# Altium schematic sheet HPS_USB.SchDoc
size A4; Organization: ICNS, MARCS Institute; Address1: Werrington South Campus, Great Western Highway; Address2: Werrington, NSW, 2747; SheetNumber: 11; SheetTotal: 16
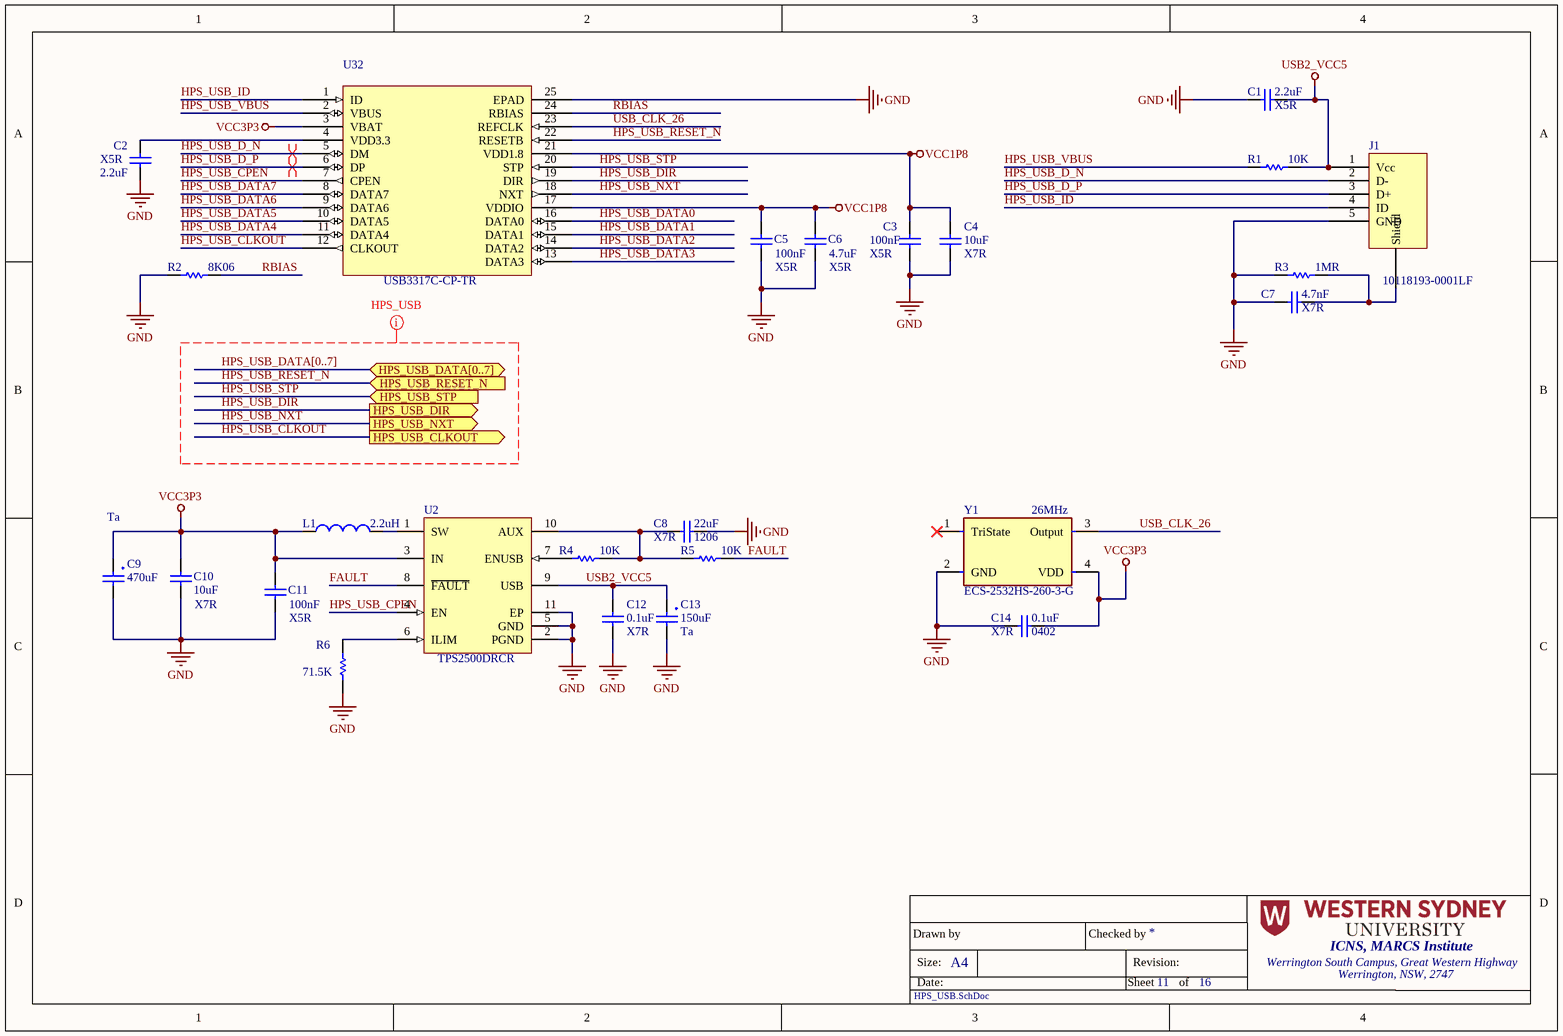
[diagram p0: HPS_USB.SchDoc]

## Parts
C1  Dielectric: X5R  Capacitance: 2.2uF  [CAP 0402 (1005)]  (hidden comment: CC0402KRX5R5BB225)
C2  Dielectric: X5R  Capacitance: 2.2uF  [CAP 0402 (1005)]  (hidden comment: CC0402KRX5R5BB225)
C3  Capacitance: 100nF  Dielectric: X5R  [CAP 0201 (0603)]  (hidden comment: CL03A104KP3NNNC)
C4  Dielectric: X7R  Capacitance: 10uF  [CAP 0805 (2012)]  (hidden comment: GCM21BR71A106KE22K)
C5  Capacitance: 100nF  Dielectric: X5R  [CAP 0201 (0603)]  (hidden comment: CL03A104KP3NNNC)
C6  Capacitance: 4.7uF  Dielectric: X5R  [CAP 0402 (1005)]  (hidden comment: C1005X5R1A475K050BC)
C7  value 4.7nF  Dielectric: X7R  [CAP 0201 (0603)]  (hidden comment: CC0201KRX7R5BB472)
C8  value 22uF  Dielectric: X7R  Case Code (Imperial): 1206  [CAPC3216X18N]  (hidden comment: CL31B226KPHNFNE)
C9  Capacitance: 470uF  Dielectric: Ta  [CAPCP3528X20M]  (hidden comment: F950J477MBAAQ2)
C10  value 10uF  Dielectric: X7R  [CAP 0805 (2012)]  (hidden comment: GCM21BR71A106KE22K)
C11  Capacitance: 100nF  Dielectric: X5R  [CAP 0201 (0603)]  (hidden comment: CL03A104KP3NNNC)
C12  value 0.1uF  Dielectric: X7R  [CAP 0402 (1005)]  (hidden comment: C0402C104M8RACTU)
C13  Capacitance: 150uF  Dielectric: Ta  [CAPMP7344X31N]  (hidden comment: TAJD157K010RNJ)
C14  value 0.1uF  Dielectric: X7R  Case/Package: 0402  [CAP 0402 (1005)]  (hidden comment: C0402C104M8RACTU)
J1  10118193-0001LF  [Micro USB]
L1  value 2.2uH  [FP-LQM18FN_00-IPC_A]  (hidden comment: LQM18FN2R2M00D)
R1  value 10K  [RES 0201 (0603)]  (hidden comment: AC0201FR-0710KL)
R2  value 8K06  [RES 0201 (0603)]  (hidden comment: RC0201FR-078K06L)
R3  value 1MR  [RES 0201 (0603)]  (hidden comment: ERJ-1GNF1004C)
R4  value 10K  [RES 0201 (0603)]  (hidden comment: AC0201FR-0710KL)
R5  value 10K  [RES 0201 (0603)]  (hidden comment: AC0201FR-0710KL)
R6  Resistance: 71.5K  [RES 0603 (1608)]  (hidden comment: RQ73C1J71K5BTD)
U2  TPS2500DRCR  [DRC0010J_V]
U32  CMP-008-000010-1  [QFN24_4X4MC_MCH]  (value not drawn)
Y1  ECS-2532HS-260-3-G  Frequency: 26MHz  [DFN210P320X110-4N]

## Ports
HPS_USB_CLKOUT (out), HPS_USB_DATA[0..7] (bidir), HPS_USB_DIR (out), HPS_USB_NXT (out), HPS_USB_RESET_N (in), HPS_USB_STP (in)

## Nets
GND: C1.2 C2.2 C3.2 C4.2 C5.2 C6.2 C7.1 C8.2 C9.2 C10.2 C11.1 C12.2 C13.2 C14.2 J1.5(GND) R2.1 R3.1 R6.2 U2.2(PGND) U2.5(GND) U2.11(EP) U32.25(EPAD) Y1.2(GND)
USB2_VCC5: C1.1 C12.1 C13.1 J1.1(Vcc) R1.2 U2.9(USB)
VCC1P8: C3.1 C4.1 C5.1 C6.1 U32.17(VDDIO) U32.21(VDD1.8)
VCC3P3: C9.1 C10.1 C11.2 C14.1 L1.1 U2.3(IN) U32.3(VBAT) Y1.4(VDD)
FAULT: R5.1 U2.8(~{FAULT})
HPS_USB_CLKOUT: U32.12(CLKOUT) ; port HPS_USB_CLKOUT
HPS_USB_CPEN: U2.4(EN) U32.7(CPEN)
HPS_USB_D_N: J1.2(D-) U32.5(DM)
HPS_USB_D_P: J1.3(D+) U32.6(DP)
HPS_USB_DATA0: U32.16(DATA0)
HPS_USB_DATA1: U32.15(DATA1)
HPS_USB_DATA2: U32.14(DATA2)
HPS_USB_DATA3: U32.13(DATA3)
HPS_USB_DATA4: U32.11(DATA4)
HPS_USB_DATA5: U32.10(DATA5)
HPS_USB_DATA6: U32.9(DATA6)
HPS_USB_DATA7: U32.8(DATA7)
HPS_USB_DIR: U32.19(DIR) ; port HPS_USB_DIR
HPS_USB_ID: J1.4(ID) U32.1(ID)
HPS_USB_NXT: U32.18(NXT) ; port HPS_USB_NXT
HPS_USB_RESET_N: U32.22(RESETB) ; port HPS_USB_RESET_N
HPS_USB_STP: U32.20(STP) ; port HPS_USB_STP
HPS_USB_VBUS: R1.1 U32.2(VBUS)
RBIAS: R2.2 U32.24(RBIAS)
USB_CLK_26: U32.23(REFCLK) Y1.3(Output)
NetC2_1: C2.1 U32.4(VDD3.3)
NetC7_2: C7.2 J1.0(Shield) R3.2
NetC8_1: C8.1 R4.1 R5.2 U2.10(AUX)
NetL1_2: L1.2 U2.1(SW)
NetR4_2: R4.2 U2.7(ENUSB)
NetR6_1: R6.1 U2.6(ILIM)

Not connected (* = marked no-connect by the designer): Y1 1(TriState)*

## Buses and harness runs
bus HPS_USB_DATA[0..7] = port HPS_USB_DATA[0..7]

## Layout directives
differential pair; differential pair class HPS_USB_D; net class DIGITAL: HPS_USB_D_N, HPS_USB_D_P
net class HPS_USB: HPS_USB_CLKOUT, HPS_USB_DATA[0..7], HPS_USB_DIR, HPS_USB_NXT, HPS_USB_RESET_N, HPS_USB_STP

## Notes on the sheet
- Drawn by
- Size:
- Date:
- A4
- Checked by
- Sheet
- Revision:
- of

## Library data of the parts
C1 C2 = CMP-003-000031-1: Cap Ceramic 2.2uF 6.3V X5R 10% SMD 0402 85C Paper T/R; Manufacturer: Yageo; Value: 2.2uF; Max Operating Temperature: 85°C; Case/Package: 0402; Min Operating Temperature: -55°C; Voltage Rating: 6.3V; RoHS Compliant: Yes; Tolerance: 10%; ComponentLink2URL: http://www.yageo.com/documents/recent/UPY-GPHC_X5R_4V-to-50V_25.pdf?src-supplier=Digi-Key; Voltage Rating (DC): 6.3V; ComponentLink3URL: http://www.yageo.com/exep/pages/download/literatures/ProductSelectionGuide%202014_Final_2.pdf?src-supplier=Digi-Key; Resistor Type: Ceramic; Packaging: Tape and Reel; Case Code (Metric): 1005; ComponentLink3Description: http://www.yageo.com/exep/pages/download/literatures/ProductSelectionGuide%202014_Final_2.pdf?src-supplier=Digi-Key; Lead Free: Lead Free; Design Item ID: CC0402KRX5R5BB225; Category: Ceramic Capacitors; Mount: Surface Mount; Halogen Free: Halogen Free; Manufacturer Part Number: CC0402KRX5R5BB225; ComponentLink2Description: http://www.yageo.com/documents/recent/UPY-GPHC_X5R_4V-to-50V_25.pdf?src-supplier=Digi-Key; Series: CC; Case Code (Imperial): 0402; Dissipation Factor: 10%; Height: 0.5mm; ComponentLink1Description: http://www.mouser.com/ds/2/447/UPY-GPHC_X5R_4V-to-50V_24-1109650.pdf?src-supplier=Mouser; RoHS: Yes; Stock 1: 10000; Radiation Hardening: No; Construction: Flat; Depth: 0.5mm; Termination: SMD/SMT; Width: 0.02inch; Pricing 1: 1=0.03110 (USD); Length: 1mm; ComponentLink1URL: http://www.mouser.com/ds/2/447/UPY-GPHC_X5R_4V-to-50V_24-1109650.pdf?src-supplier=Mouser; Source: ICNS_PropheseeLib.SchLib; Thickness: 0.022inch
C3 C5 C11 = CMP-003-000014-1: Cap Ceramic 0.1uF 10V X5R 10% Pad SMD 0201 85C T/R; Manufacturer: Samsung; Manufacturer Part Number: CL03A104KP3NNNC; Lead Free: Lead Free; RoHS: Yes; Voltage Rating: 10V; ComponentLink2URL: https://datasheet.ciiva.com/26838/getdatasheetpartid-357484-26838083.pdf?src-supplier=Verical; ComponentLink2Description: https://datasheet.ciiva.com/26838/getdatasheetpartid-357484-26838083.pdf?src-supplier=Verical; Tolerance: 10%; Height: 0.3mm; Category: Ceramic Capacitors; Case Code (Imperial): 0201; Source: ICNS_PropheseeLib.SchLib; Depth: 0.3mm; Mount: Surface Mount; Stock 1: 12175; Package Quantity: 1; Packaging: Tape and Reel; ComponentLink1Description: https://datasheet.ciiva.com/25803/cl03a104kp3nnnc-25803204.pdf?src-supplier=Digi-Key; Case Code (Metric): 0603; Width: 0.012inch; Length: 0.6mm; Radiation Hardening: No; Series: CL; Thickness: 0.013inch; Max Operating Temperature: 85°C; Design Item ID: CL03A104KP3NNNC; Voltage Rating (DC): 10V; Case/Package: 0201; Contact Plating: Tin; Min Operating Temperature: -55°C; Construction: Flat; Pricing 1: 1=0.10000, 10=0.02900, 50=0.01600, 100=0.01300, 500=0.00932, 1000=0.00732, 2500=0.00666, 5000=0.00612 (USD); ComponentLink1URL: https://datasheet.ciiva.com/25803/cl03a104kp3nnnc-25803204.pdf?src-supplier=Digi-Key
  C3 C5: Value: 0.1uF
C4 = CMP-003-000011-1: 0805 10 uF 10 V ±10 % Tolerance X7R Surface Mount Multilayer Ceramic Capacitor; Manufacturer: Murata; Value: 10uF; Tolerance: 10%; Voltage Rating: 10V; Case Code (Imperial): 0805; Category: Ceramic Capacitors; Height: 1.25mm; Mount: Surface Mount; Design Item ID: GCM21BR71A106KE22K; Voltage Rating (DC): 10V; Case Code (Metric): 2012; Ratings: AEC-Q200; RoHS: Yes; Case/Package: 0805; ComponentLink3URL: http://search.murata.co.jp/Ceramy/image/img/A01X/partnumbering_e_02.pdf?src-supplier=Digi-Key; Weight: 0.000335oz; Package Quantity: 10000; ComponentLink4Description: http://search.murata.co.jp/Ceramy/image/img/A01X/G101/ENG/GCM21BR71A106KE22-01.pdf?src-supplier=Digi-Key; Max Operating Temperature: 125°C; RoHS Compliant: Yes; Thickness: 0.055inch; Manufacturer Part Number: GCM21BR71A106KE22K; Packaging: Tape and Reel; Width: 1.25mm; ComponentLink1URL: http://www.mouser.com/ds/2/281/c03e-806517.pdf?src-supplier=Mouser; ComponentLink1Description: http://www.mouser.com/ds/2/281/c03e-806517.pdf?src-supplier=Mouser; ComponentLink2Description: https://search.murata.co.jp/Ceramy/image/img/A01X/G101/ENG/GCM21BR71A106KE22-01.pdf?src-supplier=Digi-Key; ComponentLink2URL: https://search.murata.co.jp/Ceramy/image/img/A01X/G101/ENG/GCM21BR71A106KE22-01.pdf?src-supplier=Digi-Key; Source: ICNS_PropheseeLib.SchLib; Pricing: 1=0.45000, 10=0.31600, 50=0.23880, 100=0.20790, 500=0.15400, 1000=0.13090, 2500=0.12320, 5000=0.11550 (USD); Length: 0.079inch; Stock: 4655; ComponentLink4URL: http://search.murata.co.jp/Ceramy/image/img/A01X/G101/ENG/GCM21BR71A106KE22-01.pdf?src-supplier=Digi-Key; Termination: SMD/SMT; ComponentLink3Description: http://search.murata.co.jp/Ceramy/image/img/A01X/partnumbering_e_02.pdf?src-supplier=Digi-Key; Min Operating Temperature: -55°C
C6 = CMP-003-000024-1: Cap Multilayer Ceramic 4.7uF 10 V X5R ±10 % SMT 0402  C Series; Manufacturer: TDK; Voltage Rating: 10V; Tolerance: 10%; Manufacturer Part Number: C1005X5R1A475K050BC; Lead Free: Lead Free; RoHS: Yes; ComponentLink2URL: https://datasheet.ciiva.com/14895/tdkmlcccaprange-14895671.pdf?src-supplier=Digi-Key; Value: 4.7uF; ComponentLink2Description: https://datasheet.ciiva.com/14895/tdkmlcccaprange-14895671.pdf?src-supplier=Digi-Key; Category: Ceramic Capacitors; Case Code (Imperial): 0402; Source: ICNS_PropheseeLib.SchLib; Mount: Surface Mount; Stock 1: 490145; Package Quantity: 10000; Packaging: Cut Tape; ComponentLink1Description: https://datasheet.ciiva.com/14895/tdkmlcccaprange-14895670.pdf?src-supplier=Digi-Key; Case Code (Metric): 1005; Width: 0.02inch; Length: 0.039inch; Series: C; Thickness: 0.022inch; Max Operating Temperature: 85°C; Design Item ID: C1005X5R1A475K050BC; Voltage Rating (DC): 10V; Case/Package: 0402; Min Operating Temperature: -55°C; Pricing 1: 1=0.48000, 10=0.33000, 50=0.23100, 100=0.19800, 500=0.14850, 1000=0.12540, 2500=0.11880, 5000=0.11220 (USD); ComponentLink1URL: https://datasheet.ciiva.com/14895/tdkmlcccaprange-14895670.pdf?src-supplier=Digi-Key; ComponentLink3Description: https://datasheet.ciiva.com/14895/tdkmlcccaprange-14895672.pdf?src-supplier=Digi-Key; REACH SVHC: No SVHC; ComponentLink3URL: https://datasheet.ciiva.com/14895/tdkmlcccaprange-14895672.pdf?src-supplier=Digi-Key; Dielectric Material: Ceramic
C7 = CMP-003-000018-1: Cap Ceramic 4.7nF 6.3V X7R 10% Pad SMD 0201 125C Automotive T/R; Manufacturer: Yageo; Voltage Rating: 6.3V; ComponentLink1Description: https://datasheet.ciiva.com/176/mlccorderingcode-176532.pdf?src-supplier=Digi-Key; Case Code (Metric): 0603; Width: 0.012inch; Thickness: 0.013inch; Category: Ceramic Capacitors; Pricing 1: 1=0.10000, 10=0.02400, 50=0.01320, 100=0.01080, 500=0.00770, 1000=0.00605, 2500=0.00550, 5000=0.00506 (USD); Source: ICNS_PropheseeLib.SchLib; Lead Free: Lead Free; Max Operating Temperature: 125°C; Termination: SMD/SMT; ComponentLink2Description: https://datasheet.ciiva.com/176/mlccorderingcode-176533.pdf?src-supplier=Digi-Key; ComponentLink3URL: https://datasheet.ciiva.com/176/mlccorderingcode-176531.pdf?src-supplier=Digi-Key; Case/Package: 0201; Voltage Rating (DC): 6.3V; RoHS: Yes; Series: CC; Tolerance: 10%; Resistor Type: Ceramic; Case Code (Imperial): 0201; Packaging: Tape and Reel; Capacitance: 4.7nF; Manufacturer Part Number: CC0201KRX7R5BB472; RoHS Compliant: Yes; Design Item ID: CC0201KRX7R5BB472; ComponentLink1URL: https://datasheet.ciiva.com/176/mlccorderingcode-176532.pdf?src-supplier=Digi-Key; Mount: Surface Mount; ComponentLink2URL: https://datasheet.ciiva.com/176/mlccorderingcode-176533.pdf?src-supplier=Digi-Key; Min Operating Temperature: -55°C; Stock 1: 3450; Length: 0.024inch; Halogen Free: Halogen Free; Weight: 6E-06oz; Package Quantity: 1; ComponentLink3Description: https://datasheet.ciiva.com/176/mlccorderingcode-176531.pdf?src-supplier=Digi-Key
C8 = CMP-003-000002-1: Cap Ceramic 22uF 10V X7R 10% SMD 1206 125°C Embossed Plastic T/R; Manufacturer: Samsung; Capacitance: 22uF; Voltage Rating: 10V; ComponentLink1URL: https://datasheet.ciiva.com/25724/cl31b226kphnfne-25724451.pdf?src-supplier=Digi-Key; Source: ICNS_PropheseeLib.SchLib; RoHS: Yes; Manufacturer Part Number: CL31B226KPHNFNE; Design Item ID: CL31B226KPHNFNE; Category: Ceramic Capacitors; ComponentLink1Description: https://datasheet.ciiva.com/25724/cl31b226kphnfne-25724451.pdf?src-supplier=Digi-Key; Stock: 17063; Mount: Surface Mount; Thickness: 0.071inch; Tolerance: 10%; Case/Package: 1206; Max Operating Temperature: 125°C; Min Operating Temperature: -55°C; Pricing: 1=0.49000, 10=0.34700, 50=0.26260, 100=0.22870, 500=0.16940, 1000=0.14399 (USD); Package Quantity: 1; Width: 0.063inch; Packaging: Tape and Reel; Case Code (Metric): 3216; Length: 0.126inch
C9 = CMP-003-000030-1: Cap Tant Solid 470uF 6.3V B CASE 20% 3528-20; Manufacturer: Kyocera AVX; Life (Hours): 2000Hour; ESR (Equivalent Series Resistance): 500mR; Mount: Surface Mount; Min Operating Temperature: -55°C; Max Operating Temperature: 125°C; ComponentLink1Description: http://datasheets.avx.com/F95.pdf?src-supplier=Digi-Key; Packaging: Tape and Reel; ComponentLink1URL: http://datasheets.avx.com/F95.pdf?src-supplier=Digi-Key; Case/Package: 1411; Case Code (Imperial): 1411; Voltage Rating: 6.3V; Value: 470uF; Category: Tantalum Capacitors; Features: General Purpose; Tolerance: 20%; RoHS: Yes; Case Code (Metric): 3528; Stock 1: 390; Pricing 1: 1=1.86390, 10=1.51770, 25=1.51030, 100=1.12080, 250=1.11860 (USD); Design Item ID: F950J477MBAAQ2; Source: ICNS_PropheseeLib.SchLib; RoHS Compliant: Yes; Manufacturer Part Number: F950J477MBAAQ2
C10 = CMP-003-000011-1: 0805 10 uF 10 V ±10 % Tolerance X7R Surface Mount Multilayer Ceramic Capacitor; Manufacturer: Murata; Voltage Rating (DC): 10V; Tolerance: 10%; Packaging: Tape and Reel; Width: 1.25mm; Termination: SMD/SMT; Package Quantity: 10000; Voltage Rating: 10V; Capacitance: 10uF; Case/Package: 0805; Min Operating Temperature: -55°C; Length: 0.079inch; Thickness: 0.055inch; Case Code (Imperial): 0805; Max Operating Temperature: 125°C; Height: 1.25mm; Mount: Surface Mount; Case Code (Metric): 2012; Category: Ceramic Capacitors; Design Item ID: GCM21BR71A106KE22K; Ratings: AEC-Q200; RoHS: Yes; ComponentLink3URL: http://search.murata.co.jp/Ceramy/image/img/A01X/partnumbering_e_02.pdf?src-supplier=Digi-Key; Weight: 0.000335oz; ComponentLink4Description: http://search.murata.co.jp/Ceramy/image/img/A01X/G101/ENG/GCM21BR71A106KE22-01.pdf?src-supplier=Digi-Key; RoHS Compliant: Yes; Manufacturer Part Number: GCM21BR71A106KE22K; ComponentLink1URL: http://www.mouser.com/ds/2/281/c03e-806517.pdf?src-supplier=Mouser; ComponentLink1Description: http://www.mouser.com/ds/2/281/c03e-806517.pdf?src-supplier=Mouser; ComponentLink2Description: https://search.murata.co.jp/Ceramy/image/img/A01X/G101/ENG/GCM21BR71A106KE22-01.pdf?src-supplier=Digi-Key; ComponentLink2URL: https://search.murata.co.jp/Ceramy/image/img/A01X/G101/ENG/GCM21BR71A106KE22-01.pdf?src-supplier=Digi-Key; Source: ICNS_PropheseeLib.SchLib; Pricing: 1=0.45000, 10=0.31600, 50=0.23880, 100=0.20790, 500=0.15400, 1000=0.13090, 2500=0.12320, 5000=0.11550 (USD); Stock: 4655; ComponentLink4URL: http://search.murata.co.jp/Ceramy/image/img/A01X/G101/ENG/GCM21BR71A106KE22-01.pdf?src-supplier=Digi-Key; ComponentLink3Description: http://search.murata.co.jp/Ceramy/image/img/A01X/partnumbering_e_02.pdf?src-supplier=Digi-Key
C12 C14 = CMP-003-000005-1: Cap Ceramic 0.1uF 10V X7R 20% SMD 0402 125°C Paper T/R; Manufacturer 1: KEMET; Capacitance: 100nF; Dissipation Factor: 5%; Voltage Rating: 10V; Tolerance: 20%; Max Operating Temperature: 125°C; Min Operating Temperature: -55°C; RoHS Compliant: Yes; Source: ICNS_PropheseeLib.SchLib; ComponentLink1Description: https://datasheet.ciiva.com/26948/getdatasheetpartid-791262-26948427.pdf?src-supplier=Verical; Description 1: Cap Ceramic 0.1uF 10V X7R 20% SMD 0402 125°C Paper T/R; RoHS: Yes; Package Quantity: 10000; Category: Ceramic Capacitors; Packaging: Tape and Reel; Length: 1mm; ComponentLink1URL: https://datasheet.ciiva.com/26948/getdatasheetpartid-791262-26948427.pdf?src-supplier=Verical; Lead Pitch: 0.3mm; Case Code (Imperial): 0402; Pricing 1: 1=0.00400, 25=0.00400, 100=0.00400, 250=0.00400, 500=0.00400, 1000=0.00400 (USD); Design Item ID: C0402C104M8RACTU; Radiation Hardening: No; Termination: SMD/SMT; Case Code (Metric): 1005; Stock 1: 32450; Manufacturer Part Number 1: C0402C104M8RACTU; Mount: Surface Mount; Dielectric Material: Ceramic; Depth: 0.5mm; Height: 0.5mm; Voltage Rating (DC): 10V; Thickness: 0.022inch; Series: C; Width: 0.02inch
  C12: Case/Package: 0402
C13 = CMP-003-000028-1: Cap Tant Solid 150uF 10V 2917 10%; Manufacturer: Kyocera AVX; Leakage Current: 15uA; Polarity: Polar; Dissipation Factor: 8%; ESR (Equivalent Series Resistance): 900mR; Manufacturer Part Number: TAJD157K010RNJ; Lead Free: Lead Free; RoHS: Yes; Voltage Rating: 10V; ComponentLink2URL: https://datasheet.ciiva.com/7773/1680476-7773718.pdf?src-supplier=Element14; Value: 150uF; ComponentLink2Description: https://datasheet.ciiva.com/7773/1680476-7773718.pdf?src-supplier=Element14; Tolerance: 10%; Height: 2.9mm; Category: Tantalum Capacitors; Case Code (Imperial): 2917; Source: ICNS_PropheseeLib.SchLib; Depth: 4.3mm; Mount: Surface Mount; Stock 1: 1000; Package Quantity: 1; Packaging: Tape and Reel; ComponentLink1Description: https://datasheet.ciiva.com/26341/559466-da-01-en-tacc-d-7-3-mm-x-4-3-mm-x-2-9-mm-150-uf-26341801.pdf?src-supplier=Conrad; Case Code (Metric): 7343; Width: 4.3mm; Length: 7.3mm; Radiation Hardening: No; Series: TAJ; Max Operating Temperature: 125°C; Design Item ID: TAJD157K010RNJ; Voltage Rating (DC): 10V; Case/Package: 2917; Min Operating Temperature: -55°C; Construction: Flat; Pricing 1: 1=0.91240, 10=0.70050, 25=0.69350, 100=0.50540, 250=0.50040, 500=0.48150, 1000=0.33940 (USD); ComponentLink1URL: https://datasheet.ciiva.com/26341/559466-da-01-en-tacc-d-7-3-mm-x-4-3-mm-x-2-9-mm-150-uf-26341801.pdf?src-supplier=Conrad; ComponentLink4Description: https://datasheet.ciiva.com/28515/taj-28515486.pdf?src-supplier=Element14; ComponentLink3Description: https://datasheet.ciiva.com/8080/1719052-8080375.pdf?src-supplier=Element14; ComponentLink7URL: https://datasheet.ciiva.com/264/taj-264812.pdf?src-supplier=Digi-Key; ComponentLink5Description: https://datasheet.ciiva.com/264/taj-264811.pdf?src-supplier=Digi-Key; ComponentLink6URL: https://datasheet.ciiva.com/264/taj-264810.pdf?src-supplier=Digi-Key; ComponentLink8Description: https://datasheet.ciiva.com/11228/taj-11228542.pdf?src-supplier=Avnet; ComponentLink4URL: https://datasheet.ciiva.com/28515/taj-28515486.pdf?src-supplier=Element14; ComponentLink8URL: https://datasheet.ciiva.com/11228/taj-11228542.pdf?src-supplier=Avnet; ComponentLink3URL: https://datasheet.ciiva.com/8080/1719052-8080375.pdf?src-supplier=Element14; Number of Pins: 2; Features: General Purpose; REACH SVHC: No SVHC; ComponentLink6Description: https://datasheet.ciiva.com/264/taj-264810.pdf?src-supplier=Digi-Key; ComponentLink9URL: https://datasheet.ciiva.com/16349/taj-16349831.pdf?src-supplier=Future+Electronics; ComponentLink9Description: https://datasheet.ciiva.com/16349/taj-16349831.pdf?src-supplier=Future+Electronics; Termination: SMD/SMT; ComponentLink7Description: https://datasheet.ciiva.com/264/taj-264812.pdf?src-supplier=Digi-Key; RoHS Compliant: Yes; Height - Seated (Max): 0.122inch; ComponentLink10URL: https://datasheet.ciiva.com/15163/getdatasheetpartid-111102-15163371.pdf?src-supplier=Verical; ComponentLink5URL: https://datasheet.ciiva.com/264/taj-264811.pdf?src-supplier=Digi-Key; ComponentLink10Description: https://datasheet.ciiva.com/15163/getdatasheetpartid-111102-15163371.pdf?src-supplier=Verical
J1 = CMP-010-000009-1: FCI Right Angle Surface Mount Mount Female USB Connector; 100 V ac; 1.8A; Manufacturer: Amphenol ICC / FCI; ComponentLink1URL: http://components.arrow.com/part/dataview/0323_04107372?src-supplier=Arrow+Europe; ComponentLink2URL: http://uk.rs-online.com/webdocs/1450/0900766b814507f1.pdf?src-supplier=RSComponents; ComponentLink1Description: http://components.arrow.com/part/dataview/0323_04107372?src-supplier=Arrow+Europe; ComponentLink3Description: https://cdn.amphenol-icc.com/media/wysiwyg/files/documentation/datasheet/inputoutput/io_usb_micro.pdf?src-supplier=Avnet; RoHS: No; ComponentLink3URL: https://cdn.amphenol-icc.com/media/wysiwyg/files/documentation/datasheet/inputoutput/io_usb_micro.pdf?src-supplier=Avnet; ComponentLink2Description: http://uk.rs-online.com/webdocs/1450/0900766b814507f1.pdf?src-supplier=RSComponents; ComponentLink13URL: https://cdn.amphenol-icc.com/media/wysiwyg/files/documentation/datasheet/inputoutput/io_usb_micro.pdf?src-supplier=TME; Source: ICNS_PropheseeLib.SchLib; ComponentLink9URL: https://cdn.amphenol-icc.com/media/wysiwyg/files/documentation/datasheet/inputoutput/io_usb_micro.pdf?src-supplier=Mouser; Stock 1: 3200; ComponentLink13Description: https://cdn.amphenol-icc.com/media/wysiwyg/files/documentation/datasheet/inputoutput/io_usb_micro.pdf?src-supplier=TME; Design Item ID: 10118193-0001LF; ComponentLink5Description: https://cdn.amphenol-icc.com/media/wysiwyg/files/documentation/datasheet/inputoutput/io_usb_micro.pdf?src-supplier=Onlinecomponents.com; Manufacturer Part Number: 10118193-0001LF; ComponentLink14Description: https://cdn.amphenol-icc.com/media/wysiwyg/files/documentation/datasheet/inputoutput/io_usb_micro.pdf?src-supplier=Heilind+Electronics; ComponentLink6Description: https://cdn.amphenol-icc.com/media/wysiwyg/files/documentation/datasheet/inputoutput/io_usb_micro.pdf?src-supplier=Verical; Category: USB Connectors; ComponentLink6URL: https://cdn.amphenol-icc.com/media/wysiwyg/files/documentation/datasheet/inputoutput/io_usb_micro.pdf?src-supplier=Verical; Pricing 1: 100=0.34000, 500=0.29900, 1000=0.25600, 2500=0.23900, 5000=0.22100 (USD); ComponentLink10Description: https://cdn.amphenol-icc.com/media/wysiwyg/files/documentation/datasheet/inputoutput/io_usb_micro.pdf?src-supplier=Allied+Electronics; ComponentLink11Description: https://cdn.amphenol-icc.com/media/wysiwyg/files/documentation/datasheet/inputoutput/io_usb_micro.pdf?src-supplier=RSComponents; ComponentLink9Description: https://cdn.amphenol-icc.com/media/wysiwyg/files/documentation/datasheet/inputoutput/io_usb_micro.pdf?src-supplier=Mouser; ComponentLink7URL: http://www.amphenol-icc.com/media/wysiwyg/files/drawing/10118193.pdf?src-supplier=Digi-Key; ComponentLink8Description: https://cdn.amphenol-icc.com/media/wysiwyg/files/documentation/datasheet/inputoutput/io_usb_micro.pdf?src-supplier=Digi-Key; ComponentLink5URL: https://cdn.amphenol-icc.com/media/wysiwyg/files/documentation/datasheet/inputoutput/io_usb_micro.pdf?src-supplier=Onlinecomponents.com; ComponentLink10URL: https://cdn.amphenol-icc.com/media/wysiwyg/files/documentation/datasheet/inputoutput/io_usb_micro.pdf?src-supplier=Allied+Electronics; ComponentLink12Description: https://cdn.amphenol-icc.com/media/wysiwyg/files/documentation/datasheet/inputoutput/io_usb_micro.pdf?src-supplier=TTI; ComponentLink8URL: https://cdn.amphenol-icc.com/media/wysiwyg/files/documentation/datasheet/inputoutput/io_usb_micro.pdf?src-supplier=Digi-Key; ComponentLink4Description: https://cdn.amphenol-icc.com/media/wysiwyg/files/documentation/datasheet/inputoutput/io_usb_micro.pdf?src-supplier=Arrow+Electronics; ComponentLink7Description: http://www.amphenol-icc.com/media/wysiwyg/files/drawing/10118193.pdf?src-supplier=Digi-Key; ComponentLink14URL: https://cdn.amphenol-icc.com/media/wysiwyg/files/documentation/datasheet/inputoutput/io_usb_micro.pdf?src-supplier=Heilind+Electronics; ComponentLink11URL: https://cdn.amphenol-icc.com/media/wysiwyg/files/documentation/datasheet/inputoutput/io_usb_micro.pdf?src-supplier=RSComponents; ComponentLink4URL: https://cdn.amphenol-icc.com/media/wysiwyg/files/documentation/datasheet/inputoutput/io_usb_micro.pdf?src-supplier=Arrow+Electronics; ComponentLink12URL: https://cdn.amphenol-icc.com/media/wysiwyg/files/documentation/datasheet/inputoutput/io_usb_micro.pdf?src-supplier=TTI
L1 = CMP-005-000006-1: Inductor Power Chip Shielded Multi-Layer 2.2uH 20% 1MHz Ferrite 0.12A 0.52Ohm DCR 0603 T/R; Manufacturer: Murata; DC Resistance (DCR): 520mR; DC Current: 120mA; Self Resonant Frequency: 80MHz; Military Standard: Not; ComponentLink4Description: https://datasheet.ciiva.com/1039/l0075s0097lqm18f-1039457.pdf?src-supplier=Digi-Key; ComponentLink4URL: https://datasheet.ciiva.com/1039/l0075s0097lqm18f-1039457.pdf?src-supplier=Digi-Key; Case/Package: 0603; ComponentLink2Description: https://datasheet.ciiva.com/3866/288lqm18fn2r2m0023-3866055.pdf?src-supplier=Arrow+Electronics; Tolerance: 20%; Mount: Surface Mount; ComponentLink1Description: https://datasheet.ciiva.com/1039/l0075s0097lqm18f-1039456.pdf?src-supplier=Digi-Key; Height - Seated (Max): 0.035inch; Shielding: Shielded; ComponentLink5URL: https://datasheet.ciiva.com/1039/l0075s0097lqm18f-1039458.pdf?src-supplier=Digi-Key; Lead Free: Lead Free; Min Operating Temperature: -55°C; Saturation Current: 120mA; Category: Fixed Inductors; Source: ICNS_PropheseeLib.SchLib; ComponentLink3URL: https://datasheet.ciiva.com/11802/0900766b80f15512-11802633.pdf?src-supplier=RSComponents; ComponentLink1URL: https://datasheet.ciiva.com/1039/l0075s0097lqm18f-1039456.pdf?src-supplier=Digi-Key; ComponentLink6Description: https://datasheet.ciiva.com/17277/l0075s0097lqm18f-17277643.pdf?src-supplier=Avnet+Europe; Max DC Current: 120mA; Length: 0.063inch; ComponentLink6URL: https://datasheet.ciiva.com/17277/l0075s0097lqm18f-17277643.pdf?src-supplier=Avnet+Europe; Manufacturer Part Number: LQM18FN2R2M00D; Pricing 1: 25=0.13900, 50=0.11800, 500=0.10500, 1000=0.09000, 2500=0.08300 (USD); Depth: 0.9mm; Weight: 7.1E-05oz; Test Frequency: 1MHz; Height: 0.9mm; Case Code (Imperial): 0603; ComponentLink5Description: https://datasheet.ciiva.com/1039/l0075s0097lqm18f-1039458.pdf?src-supplier=Digi-Key; ComponentLink3Description: https://datasheet.ciiva.com/11802/0900766b80f15512-11802633.pdf?src-supplier=RSComponents; Design Item ID: LQM18FN2R2M00D; ComponentLink2URL: https://datasheet.ciiva.com/3866/288lqm18fn2r2m0023-3866055.pdf?src-supplier=Arrow+Electronics; Series: LQM18F; Radiation Hardening: No; Inductance: 2.2uH; Width: 0.031inch; Packaging: Tape and Reel; Package Quantity: 4000; Termination: SMD/SMT; Case Code (Metric): 1608; Current Rating: 120mA; RoHS: Yes; Stock 1: 1; Core Material: Ferrite; Max Operating Temperature: 125°C
R1 R4 R5 = CMP-006-000021-1: Res Thick Film 0201 10K Ohm 1% 0.05W(1/20W) ±200ppm/C Pad SMD Automotive T/R; Manufacturer: Yageo; Max Power Dissipation: 50mW; Resistance: 10kR; Temperature Coefficient: 200ppm/°C; Length: 0.024inch; Packaging: Tape and Reel; ComponentLink1URL: http://www.yageo.com/NewPortal/yageodocoutput?fileName=/pdf/R-Chip/PYu-AC_51_RoHS_L_6.pdf&src-supplier=Digi-Key; Number of Terminations: 2; Case/Package: 0201; Source: ICNS_PropheseeLib.SchLib; Case Code (Metric): 0603; Manufacturer Part Number: AC0201FR-0710KL; ComponentLink1Description: http://www.yageo.com/NewPortal/yageodocoutput?fileName=/pdf/R-Chip/PYu-AC_51_RoHS_L_6.pdf&src-supplier=Digi-Key; Min Operating Temperature: -55°C; Category: Chip SMD Resistors; Width: 0.012inch; RoHS: Yes; Max Operating Temperature: 155°C; Features: Moisture Resistant,Automotive AEC-Q200; Pricing 1: 1=0.10000, 10=0.06600, 100=0.02670, 1000=0.01201, 2500=0.01042, 5000=0.00861 (USD); Case Code (Imperial): 0201; Resistor Type: Thick Film; Stock 1: 698280; Design Item ID: AC0201FR-0710KL; Height: 0.01inch; Tolerance: 1%
R2 = CMP-006-000054-1: Res Thick Film 0201 8.06K Ohm 1% 1/20W ±200ppm/°C Molded SMD Paper T/R; Manufacturer: Yageo; Resistance: 8.06kR; Max Power Dissipation: 50mW; Height: 0.01inch; Packaging: Tape and Reel; Length: 0.024inch; Case Code (Metric): 0603; Min Operating Temperature: -55°C; Case Code (Imperial): 0201; Tolerance: 1%; ComponentLink1URL: http://components.arrow.com/part/dataview/0323_03291877?src-supplier=Arrow+Europe; ComponentLink2URL: http://www.yageo.com.tw/exep/pages/download/literatures/PYu-R_INT-thick_7.pdf?src-supplier=Digi-Key; ComponentLink2Description: http://www.yageo.com.tw/exep/pages/download/literatures/PYu-R_INT-thick_7.pdf?src-supplier=Digi-Key; Max Operating Temperature: 125°C; ComponentLink1Description: http://components.arrow.com/part/dataview/0323_03291877?src-supplier=Arrow+Europe; Width: 0.012inch; Depth: 0.3mm; ComponentLink3Description: http://www.yageo.com/documents/recent/PYu-RC_Group_51_RoHS_L_9.pdf?src-supplier=Digi-Key; Number of Terminations: 2; ComponentLink3URL: http://www.yageo.com/documents/recent/PYu-RC_Group_51_RoHS_L_9.pdf?src-supplier=Digi-Key; Design Item ID: RC0201FR-078K06L; Case/Package: 0201; Resistor Type: Thick Film; RoHS Compliant: Yes; RoHS: Yes; Stock 1: 38520; Category: Chip SMD Resistors; Military Standard: Not; Manufacturer Part Number: RC0201FR-078K06L; Source: ICNS_PropheseeLib.SchLib; Features: Moisture Resistant; Pricing 1: 1=0.03600, 10=0.01500, 25=0.01200, 50=0.01000, 100=0.00700 (USD); Temperature Coefficient: 200ppm/°C
R3 = CMP-006-000042-1: Res Thick Film 0201 1M Ohm 1% 0.05W(1/20W) ±200ppm/C Pad SMD Automotive T/R; Manufacturer: Panasonic; Working Voltage: 25V; Max Power Dissipation: 50mW; Temperature Coefficient: 200ppm/°C; Technology: THICK FILM; Case Code (Metric): 0603; ComponentLink5URL: https://datasheet.ciiva.com/16201/aoa0000ce2-16201493.pdf?src-supplier=Future+Electronics; ComponentLink5Description: https://datasheet.ciiva.com/16201/aoa0000ce2-16201493.pdf?src-supplier=Future+Electronics; Resistor Type: Thick Film; ComponentLink4URL: https://datasheet.ciiva.com/22742/1678782-22742861.pdf?src-supplier=Element14; Length: 0.6mm; Max Operating Temperature: 125°C; Resistance Tolerance: 1%; ComponentLink2URL: https://datasheet.ciiva.com/46375/1678782-46375423.pdf?src-supplier=Element14; Min Operating Temperature: -55°C; Manufacturer Part Number: ERJ-1GNF1004C; Voltage Rating: 25V; Category: Chip SMD Resistors; Case/Package: 0201; ComponentLink3Description: https://datasheet.ciiva.com/22742/1678782-22742862.pdf?src-supplier=Element14; Package Quantity: 15000; RoHS: Yes; Radiation Hardening: No; Number of Terminations: 2; Voltage Rating (DC): 25V; Case Code (Imperial): 0201; Power Rating: 50mW; ComponentLink2Description: https://datasheet.ciiva.com/46375/1678782-46375423.pdf?src-supplier=Element14; ComponentLink3URL: https://datasheet.ciiva.com/22742/1678782-22742862.pdf?src-supplier=Element14; Tolerance: 1%; Design Item ID: ERJ-1GNF1004C; Mount: Surface Mount; Pricing 1: 1=0.10000, 10=0.06500, 100=0.02660, 1000=0.01192, 2500=0.01035, 5000=0.00855 (USD); Width: 0.3mm; Stock 1: 1665; REACH SVHC: No SVHC; Lead Free: Lead Free; Number of Pins: 2; Contact Plating: Tin,Matte; Source: ICNS_PropheseeLib.SchLib; Series: ERJ; Packaging: Tape and Reel; Resistance: 1MR; ComponentLink1URL: https://datasheet.ciiva.com/43467/1678782-43467126.pdf?src-supplier=Farnell; ComponentLink1Description: https://datasheet.ciiva.com/43467/1678782-43467126.pdf?src-supplier=Farnell; ComponentLink4Description: https://datasheet.ciiva.com/22742/1678782-22742861.pdf?src-supplier=Element14; Height: 0.01inch
R6 = CMP-006-000056-1: Res Thin Film 0603  71.5kOhm 0.1% 150mW 10ppm/°C 2-Pin SMD T/R; Manufacturer: TE Connectivity; Value: 71K5; Tolerance: 1%; RoHS: Yes; Manufacturer Part Number: RQ73C1J71K5BTD; Temperature Coefficient: 10ppm/°C; Category: Chip SMD Resistors; ComponentLink1Description: https://media.digikey.com/pdf/Data%20Sheets/Tyco%20Electronics%20P%20B%20PDFs/RQ73-0618%20v2.pdf?src-supplier=Digi-Key; Stock 1: 9106; Pricing 1: 1=0.83000, 10=0.68800, 100=0.46180, 1000=0.27018, 2500=0.26134 (USD); Max Power Dissipation: 150mW; Case/Package: 0603; Design Item ID: RQ73C1J71K5BTD; Source: ICNS_PropheseeLib.SchLib; Case Code (Metric): 1608; ComponentLink1URL: https://media.digikey.com/pdf/Data%20Sheets/Tyco%20Electronics%20P%20B%20PDFs/RQ73-0618%20v2.pdf?src-supplier=Digi-Key
U2 = CMP-012-000001-1: Power Switch/Driver 1:2 N/P-Channel 1.4A 10-VSON (3x3); Manufacturer: Texas Instruments; Number of Switches: 1; Max Supply Voltage: 5.25V; Min Input Voltage: 1.8V; Bandwidth: 1MHz; Number of Outputs: 2; ComponentLink1URL: https://datasheet.ciiva.com/3235/tps2501-3235090.pdf?src-supplier=Avnet; ComponentLink1Description: https://datasheet.ciiva.com/3235/tps2501-3235090.pdf?src-supplier=Avnet; Max Operating Temperature: 85°C; Design Item ID: TPS2500DRCR; Series: -; Manufacturer Part Number: TPS2500DRCR; Stock 1: 160; Lead Free: Lead Free; ComponentLink7URL: https://datasheet.ciiva.com/16467/tps2501-16467210.pdf?src-supplier=Avnet+Asia; Min Supply Voltage: 1.8V; ComponentLink6URL: https://datasheet.ciiva.com/1963/tps2500-1963868.pdf?src-supplier=Digi-Key; ComponentLink2Description: https://datasheet.ciiva.com/15108/getdatasheetpartid-534311-15108632.pdf?src-supplier=Verical; Case/Package: VSON; Min Operating Temperature: -40°C; ComponentLink7Description: https://datasheet.ciiva.com/16467/tps2501-16467210.pdf?src-supplier=Avnet+Asia; Number of Pins: 10; Package Quantity: 3000; Pricing 1: 1=2.10000, 10=1.89000, 25=1.78360, 100=1.51950, 250=1.42676, 500=1.24842, 1000=1.17775 (USD); Radiation Hardening: No; ComponentLink4URL: https://datasheet.ciiva.com/1963/tps2500-1963866.pdf?src-supplier=Digi-Key; ComponentLink5URL: https://datasheet.ciiva.com/1963/tps2500-1963867.pdf?src-supplier=Digi-Key; RoHS: Yes; RoHS Compliant: Yes; ComponentLink5Description: https://datasheet.ciiva.com/1963/tps2500-1963867.pdf?src-supplier=Digi-Key; ComponentLink3Description: https://datasheet.ciiva.com/26882/tps2500drcr-26882145.pdf?src-supplier=IIIC; Category: Hot Swap Controllers; Max Input Voltage: 5.25V; ComponentLink2URL: https://datasheet.ciiva.com/15108/getdatasheetpartid-534311-15108632.pdf?src-supplier=Verical; Packaging: Tape and Reel; ComponentLink6Description: https://datasheet.ciiva.com/1963/tps2500-1963868.pdf?src-supplier=Digi-Key; ComponentLink3URL: https://datasheet.ciiva.com/26882/tps2500drcr-26882145.pdf?src-supplier=IIIC; Source: ICNS_PropheseeLib.SchLib; ComponentLink4Description: https://datasheet.ciiva.com/1963/tps2500-1963866.pdf?src-supplier=Digi-Key
U32 = CMP-008-000010-1: Hi-Speed USB Transceiver with 1.8V-3.3V ULPI Interface - 26MHz Reference Clock; Manufacturer: Microchip; Data Rate: 480Mbps; Number of Transceivers: 1; Max Dual Supply Voltage: 5.5V; Operating Supply Voltage: 3.3V; ESD Protection: Yes; Width: 4.15mm; Mount: Surface Mount; Manufacturer Part Number: USB3317C-CP-TR; ComponentLink3Description: https://datasheet.ciiva.com/6635/3317db-6635533.pdf?src-supplier=Digi-Key; Pricing 1: 5=1.50900, 25=1.46600, 100=1.41300 (USD); Number of Pins: 24; Length: 4.15mm; Design Item ID: USB3317C-CP-TR; Min Operating Temperature: -40°C; Lead Free: Lead Free; RoHS: Yes; Packaging: Tape and Reel; Source: ICNS_PropheseeLib.SchLib; Weight: 0.032741oz; ComponentLink1URL: https://datasheet.ciiva.com/16513/usb3317c-cp-tr-16513122.pdf?src-supplier=Future+Electronics; RoHS Compliant: Yes; Package Quantity: 4000; Category: Interface ICs; Radiation Hardening: No; ComponentLink1Description: https://datasheet.ciiva.com/16513/usb3317c-cp-tr-16513122.pdf?src-supplier=Future+Electronics; Max Operating Temperature: 85°C; ComponentLink2Description: https://datasheet.ciiva.com/6635/3317db-6635531.pdf?src-supplier=Digi-Key; ComponentLink3URL: https://datasheet.ciiva.com/6635/3317db-6635533.pdf?src-supplier=Digi-Key; Series: flexPWR™; Stock 1: 520; Height: 0.95mm; ComponentLink2URL: https://datasheet.ciiva.com/6635/3317db-6635531.pdf?src-supplier=Digi-Key; Case/Package: QFN
Y1 = CMP-017-000001-1: Oscillator XO 26MHz ±10ppm 15pF CMOS 55% 3.3V 4-Pin CSMD; Manufacturer: ECS International; Max Supply Current: 10mA; Mount: Surface Mount; RoHS Compliant: Yes; Frequency Stability: 10ppm; Package Quantity: 1; Height: 0.039inch; Packaging: Tape and Reel; Series: ECS-2532HS; Length: 0.126inch; Width: 0.098inch; Case/Package: SMD/SMT; Max Operating Temperature: 85°C; Min Operating Temperature: -40°C; Design Item ID: ECS-2532HS-260-3-G; Pricing 1: 1=6.25400, 10=6.15600, 25=6.05800, 50=5.96000, 100=5.86200, 250=5.76400 (USD); ComponentLink3URL: https://datasheet.ciiva.com/865/ecs-2532hs-865690.pdf?src-supplier=Digi-Key; ComponentLink3Description: https://datasheet.ciiva.com/865/ecs-2532hs-865690.pdf?src-supplier=Digi-Key; RoHS: Yes; Category: Oscillators; Source: ICNS_PropheseeLib.SchLib; ComponentLink2Description: https://datasheet.ciiva.com/865/ecs-2532hs-865689.pdf?src-supplier=Digi-Key; Manufacturer Part Number: ECS-2532HS-260-3-G; ComponentLink1Description: https://datasheet.ciiva.com/865/ecs-2532hs-865688.pdf?src-supplier=Digi-Key; ComponentLink2URL: https://datasheet.ciiva.com/865/ecs-2532hs-865689.pdf?src-supplier=Digi-Key; ComponentLink1URL: https://datasheet.ciiva.com/865/ecs-2532hs-865688.pdf?src-supplier=Digi-Key; Stock 1: 480; Lead Free: Lead Free